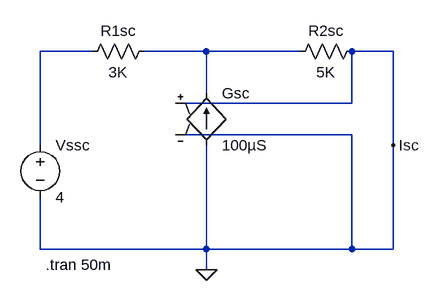
[diagram p0: schematic circuitSC.asc]
circuitSC.asc, the LTspice schematic file:
Version 4
SHEET 1 984 680
WIRE 192 -16 112 -16
WIRE 368 -16 272 -16
WIRE 512 -16 368 -16
WIRE 656 -16 592 -16
WIRE 368 48 368 -16
WIRE 592 64 592 -16
WIRE 592 64 320 64
WIRE 592 112 320 112
WIRE 112 128 112 -16
WIRE 656 128 656 -16
WIRE 112 288 112 208
WIRE 368 288 368 128
WIRE 368 288 112 288
WIRE 592 288 592 112
WIRE 592 288 368 288
WIRE 656 288 656 128
WIRE 656 288 592 288
WIRE 368 320 368 288
FLAG 368 320 0
FLAG 656 128 Isc
SYMBOL voltage 112 112 R0
WINDOW 123 0 0 Left 2
WINDOW 39 0 0 Left 2
SYMATTR InstName Vssc
SYMATTR Value 4
SYMBOL res 176 0 R270
WINDOW 0 32 56 VTop 2
WINDOW 3 0 56 VBottom 2
SYMATTR InstName R1sc
SYMATTR Value 3K
SYMBOL g 368 32 R0
SYMATTR InstName Gsc
SYMATTR Value 100µS
SYMBOL res 608 -32 R90
WINDOW 0 0 56 VBottom 2
WINDOW 3 32 56 VTop 2
SYMATTR InstName R2sc
SYMATTR Value 5K
TEXT 120 312 Left 2 !.tran 50m

The netlist it stands for:
* circuitSC.asc
Vssc N001 0 4
R1sc N001 N002 3K
Gsc 0 N002 0 0 100µS
R2sc 0 N002 5K
.tran 50m
.backanno
.end